# Altium schematic sheet CombCombiner.SchDoc
size Letter
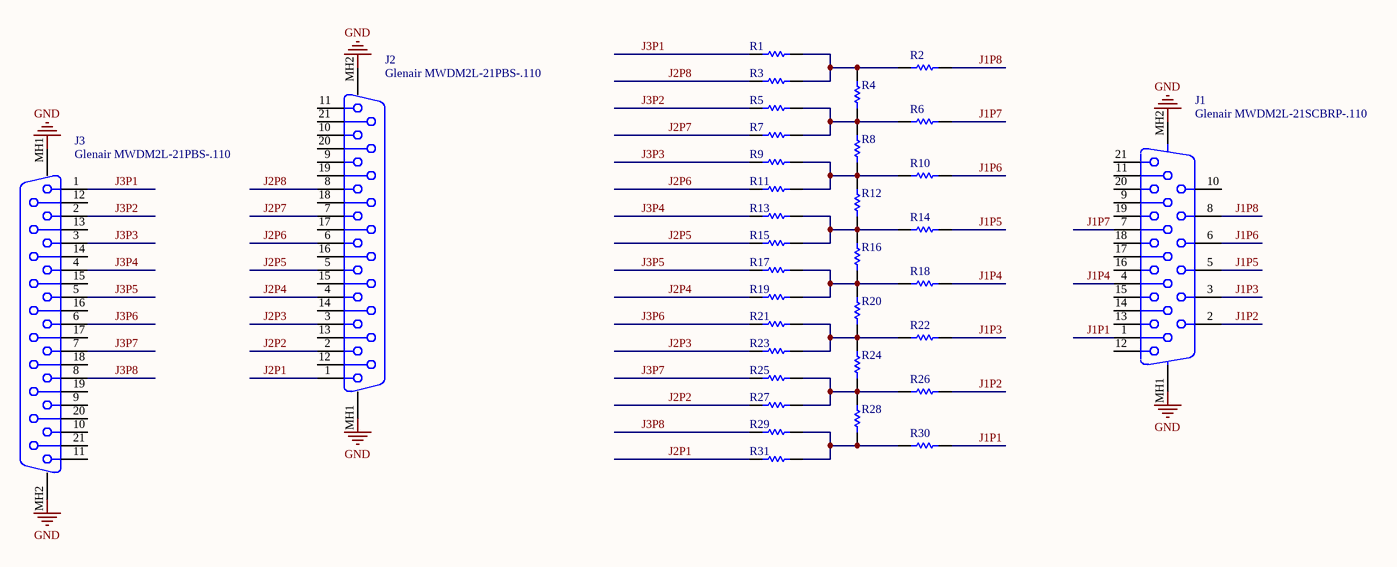
[diagram p0: CombCombiner.SchDoc]

## Parts
J1  Glenair MWDM2L-21SCBRP-.110  [MicroD21Glenair-RA3row]
J2  Glenair MWDM2L-21PBS-.110  [MicroD21Glenair-Vert2row]
J3  Glenair MWDM2L-21PBS-.110  [MicroD21Glenair-Vert2row]
R1  Res0603  [0603]  (value not drawn)
R2  Res0603  [0603]  (value not drawn)
R3  Res0603  [0603]  (value not drawn)
R4  Res0603  [0603]  (value not drawn)
R5  Res0603  [0603]  (value not drawn)
R6  Res0603  [0603]  (value not drawn)
R7  Res0603  [0603]  (value not drawn)
R8  Res0603  [0603]  (value not drawn)
R9  Res0603  [0603]  (value not drawn)
R10  Res0603  [0603]  (value not drawn)
R11  Res0603  [0603]  (value not drawn)
R12  Res0603  [0603]  (value not drawn)
R13  Res0603  [0603]  (value not drawn)
R14  Res0603  [0603]  (value not drawn)
R15  Res0603  [0603]  (value not drawn)
R16  Res0603  [0603]  (value not drawn)
R17  Res0603  [0603]  (value not drawn)
R18  Res0603  [0603]  (value not drawn)
R19  Res0603  [0603]  (value not drawn)
R20  Res0603  [0603]  (value not drawn)
R21  Res0603  [0603]  (value not drawn)
R22  Res0603  [0603]  (value not drawn)
R23  Res0603  [0603]  (value not drawn)
R24  Res0603  [0603]  (value not drawn)
R25  Res0603  [0603]  (value not drawn)
R26  Res0603  [0603]  (value not drawn)
R27  Res0603  [0603]  (value not drawn)
R28  Res0603  [0603]  (value not drawn)
R29  Res0603  [0603]  (value not drawn)
R30  Res0603  [0603]  (value not drawn)
R31  Res0603  [0603]  (value not drawn)

## Nets
GND: J1.MH1 J1.MH2 J2.MH1 J2.MH2 J3.MH1 J3.MH2
J1P1: J1.1 R30.1
J1P2: J1.2 R26.1
J1P3: J1.3 R22.1
J1P4: J1.4 R18.1
J1P5: J1.5 R14.1
J1P6: J1.6 R10.1
J1P7: J1.7 R6.1
J1P8: J1.8 R2.2
J2P1: J2.1 R31.2
J2P2: J2.2 R27.2
J2P3: J2.3 R23.2
J2P4: J2.4 R19.2
J2P5: J2.5 R15.2
J2P6: J2.6 R11.2
J2P7: J2.7 R7.2
J2P8: J2.8 R3.2
J3P1: J3.1 R1.2
J3P2: J3.2 R5.2
J3P3: J3.3 R9.2
J3P4: J3.4 R13.2
J3P5: J3.5 R17.2
J3P6: J3.6 R21.2
J3P7: J3.7 R25.2
J3P8: J3.8 R29.2
NetR1_1: R1.1 R2.1 R3.1 R4.2
NetR4_1: R4.1 R5.1 R6.2 R7.1 R8.2
NetR8_1: R8.1 R9.1 R10.2 R11.1 R12.2
NetR12_1: R12.1 R13.1 R14.2 R15.1 R16.2
NetR16_1: R16.1 R17.1 R18.2 R19.1 R20.2
NetR20_1: R20.1 R21.1 R22.2 R23.1 R24.2
NetR24_1: R24.1 R25.1 R26.2 R27.1 R28.2
NetR28_1: R28.1 R29.1 R30.2 R31.1

Not connected (* = marked no-connect by the designer): J1 9 10 11 12 13 14 15 16 17 18 19 20 21; J2 9 10 11 12 13 14 15 16 17 18 19 20 21; J3 9 10 11 12 13 14 15 16 17 18 19 20 21

## Library data of the parts
J1 = GlenairMicroDsub21-3row: GlenairMicroDsub21 - 3 row; PackageDescription: Connector; D-Sub, Thru-Hole; 9 Position; Vertical; Body 30.81 x 9.60 x 8.20 mm (LxWxH)
J2 J3 = GlenairMicroDsub21 -2 row
R1-R31 = Res0603: RES 100K OHM 1/10W 1% 0603 SMD; Manufacturers P/N: e.g CRCW0603100KFKEA; Manufacturer: e.g Vishay/Dale; Part constraints: 100k 0603 1%; Param1: 100ppm/C; CanPurchaseFrom: Digikey; TechInfo: *